# Altium schematic sheet servos.SchDoc: Eye servos
size A4; Organization: GPA Robotics; DocumentNumber: 3; Revision: REV 0; SheetNumber: 3; SheetTotal: 11
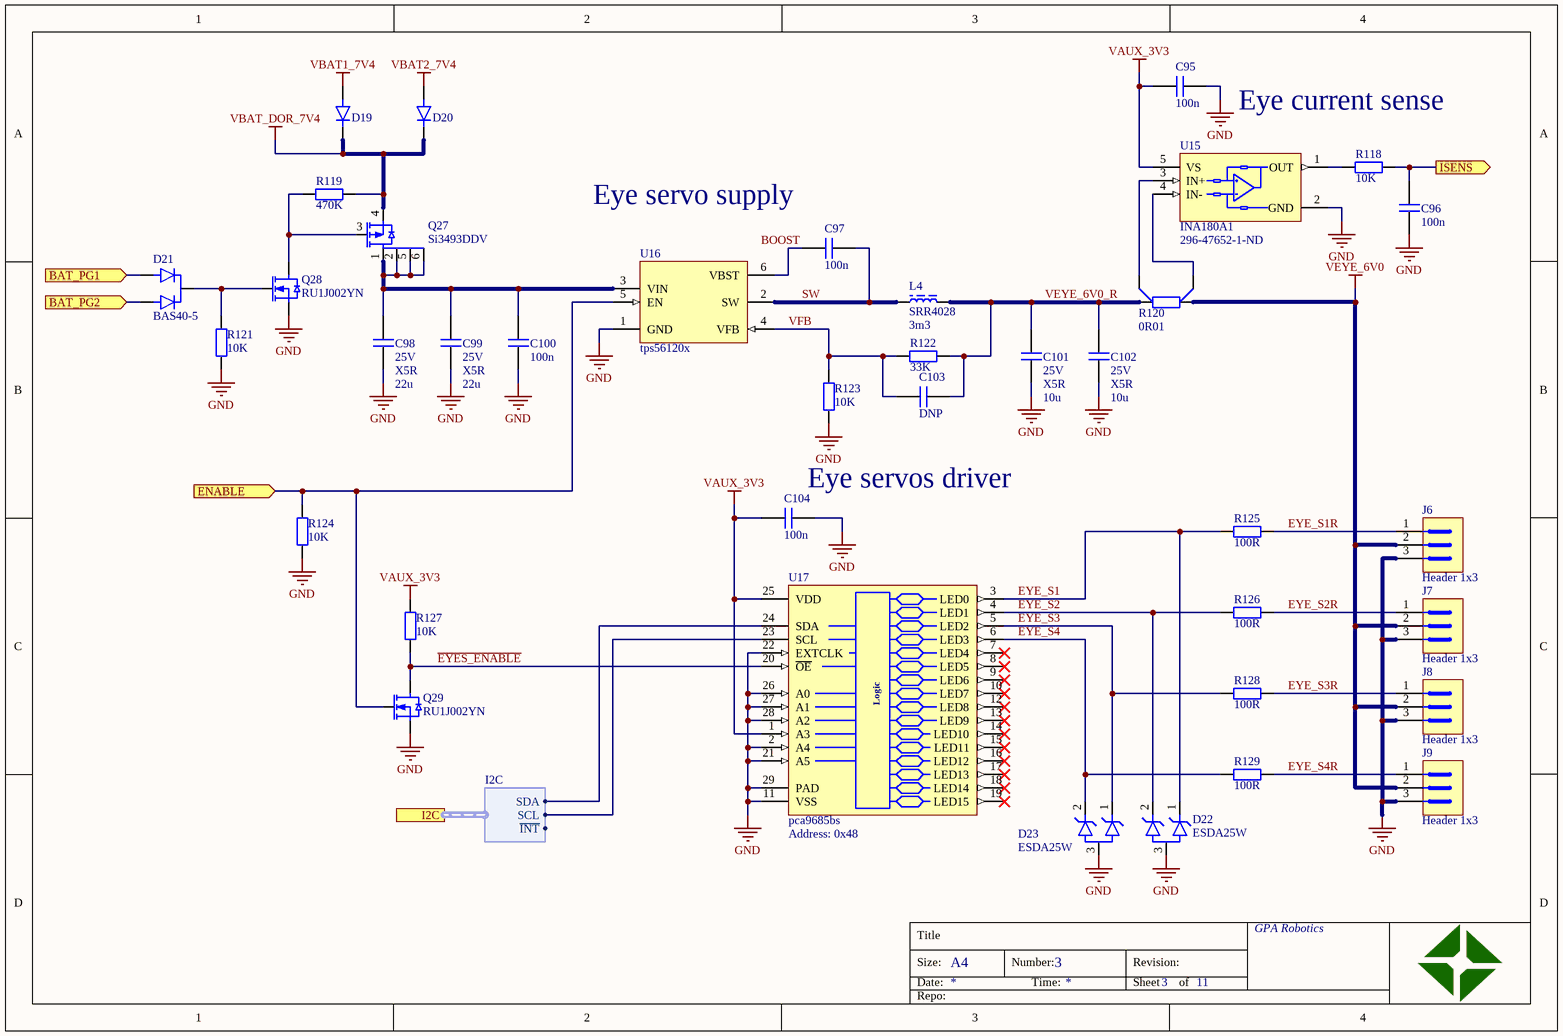
[diagram p0: servos.SchDoc]

## Parts
C95  value 100n  [CAPC1005X06N]  (hidden comment: cap)
C96  value 100n  [CAPC1005X06N]  (hidden comment: cap)
C97  value 100n  [CAPC1005X06N]  (hidden comment: cap)
C98  value 22u  voltage: 25V  type: X5R  [CAPC3216X14N]  (hidden comment: cap)
C99  value 22u  voltage: 25V  type: X5R  [CAPC3216X14N]  (hidden comment: cap)
C100  value 100n  [CAPC1005X06N]  (hidden comment: cap)
C101  value 10u  voltage: 25V  type: X5R  [CAPC3216X14N]  (hidden comment: cap)
C102  value 10u  voltage: 25V  type: X5R  [CAPC3216X14N]  (hidden comment: cap)
C103  value DNP  [CAPC1005X06N]  (hidden comment: cap)
C104  value 100n  [CAPC1005X06N]  (hidden comment: cap)
D19  DFLS2100  [SODFL370X100-2N_DFLS2100]  (value not drawn)
D20  DFLS2100  [SODFL370X100-2N_DFLS2100]  (value not drawn)
D21  BAS40-5  [SOT23_CC]
D22  ESDA25W  [SOT65P210X110-3N_SOT323-3L]
D23  ESDA25W  [SOT65P210X110-3N_SOT323-3L]
J6  Header 1x3  [HEADER_1x3_100MIL]
J7  Header 1x3  [HEADER_1x3_100MIL]
J8  Header 1x3  [HEADER_1x3_100MIL]
J9  Header 1x3  [HEADER_1x3_100MIL]
L4  SRR4028  value 3m3  [SRR4028]
Q27  Si3493DDV  [SOT95P284X110-6N_TSOP6]
Q28  RU1J002YN  [SOTFL65P210X105-3N]
Q29  RU1J002YN  [SOTFL65P210X105-3N]
R118  value 10K  [RESC1005X04N]  (hidden comment: res)
R119  value 470K  [RESC1005X04N]  (hidden comment: res)
R120  value 0R01  [4T_RESC1632X05N]  (hidden comment: res_4t)
R121  value 10K  [RESC1005X04N]  (hidden comment: res)
R122  value 33K  [RESC1005X04N]  (hidden comment: res)
R123  value 10K  [RESC1005X04N]  (hidden comment: res)
R124  value 10K  [RESC1005X04N]  (hidden comment: res)
R125  value 100R  [RESC1005X04N]  (hidden comment: res)
R126  value 100R  [RESC1005X04N]  (hidden comment: res)
R127  value 10K  [RESC1005X04N]  (hidden comment: res)
R128  value 100R  [RESC1005X04N]  (hidden comment: res)
R129  value 100R  [RESC1005X04N]  (hidden comment: res)
U15  INA180A1  Supplier Part Number 1: 296-47652-1-ND  [SOT95P280X145-5N]
U16  tps56120x  [SOT95P280X110-6N]
U17  pca9685bs  Address: 0x48  [QFN65P600X600X100_HS-29N_PCA9685BS]

## Ports
BAT_PG1 (in), BAT_PG2 (in), ENABLE (in), I2C (harness I2C), ISENS (out)

## Harnesses
I2C: SDA, SCL, ~{INT}

## Nets
GND: C95.1 C96.1 C98.1 C99.1 C100.1 C101.1 C102.1 C104.2 D22.3 D23.3 J6.3 J7.3 J8.3 J9.3 Q28.2(S) Q29.2(S) R121.1 R123.1 R124.1 U15.2(GND) U16.1(GND) U17.2(A4) U17.11(VSS) U17.21(A5) U17.22(EXTCLK) U17.26(A0) U17.27(A1) U17.28(A2) U17.29(PAD)
VAUX_3V3: C95.2 C104.1 R127.2 U15.5(VS) U17.1(A3) U17.25(VDD)
VBAT1_7V4: D19.A
VBAT2_7V4: D20.A
VBAT_DOR_7V4: D19.C D20.C Q27.4(S) R119.2
VEYE_6V0: J6.2 J7.2 J8.2 J9.2 R120.2
~{EYES_ENABLE}: Q29.3(D) R127.1 U17.20(~{OE})
BAT_PG1: D21.A1 ; port BAT_PG1
BAT_PG2: D21.A2 ; port BAT_PG2
BOOST: C97.1 U16.6(VBST)
ENABLE: Q29.1(G) R124.2 U16.5(EN) ; port ENABLE
EYE_S1: D22.1 R125.1 U17.3(LED0)
EYE_S1R: J6.1 R125.2
EYE_S2: D22.2 R126.1 U17.4(LED1)
EYE_S2R: J7.1 R126.2
EYE_S3: D23.1 R128.1 U17.5(LED2)
EYE_S3R: J8.1 R128.2
EYE_S4: D23.2 R129.1 U17.6(LED3)
EYE_S4R: J9.1 R129.2
ISENS: C96.2 R118.2 ; port ISENS
SW: C97.2 L4.1 U16.2(SW)
VEYE_6V0_R: C101.2 C102.2 C103.2 L4.2 R120.1 R122.2
VFB: C103.1 R122.1 R123.2 U16.4(VFB)
NetC98_2: C98.2 C99.2 C100.2 Q27.1(D) Q27.2(D) Q27.5(D) Q27.6(D) U16.3(VIN)
NetD21_C: D21.C Q28.1(G) R121.2
NetQ27_3: Q27.3(G) Q28.3(D) R119.1
NetR118_1: R118.1 U15.1(OUT)
NetR120_3: R120.3 U15.3(IN+)
NetR120_4: R120.4 U15.4(IN-)
NetU17_23: U17.23(SCL) ; port I2C.SCL
NetU17_24: U17.24(SDA) ; port I2C.SDA

Not connected (* = marked no-connect by the designer): U17 7(LED4)* 8(LED5)* 9(LED6)* 10(LED7)* 12(LED8)* 13(LED9)* 14(LED10)* 15(LED11)* 16(LED12)* 17(LED13)* 18(LED14)* 19(LED15)*

## Notes on the sheet
- Eye current sense
- Eye servo supply
- (near C104) Eye servos driver
- Title
- Size:
- Date:
- A4
- Number:
- Time:
- Revision:
- Sheet
- of
- Repo:
- (in symbol pca9685bs) Logic

## Library data of the parts
C95-C104 = cap: Capacitor; #digikey: *; #mouser: *
  C95-C97 C100 C103 C104: voltage: *; type: *
D19 D20 = dfls2100: 2.0A HIGH VOLTAGE SCHOTTKY BARRIER RECTIFIER; ComponentLink1Description: datasheet; ComponentLink1URL: https://www.diodes.com/assets/Datasheets/ds31475.pdf
D21 = diode_dual_cc: Diode Common Cathode
D22 D23 = esda25w: TRANSIL array for data protection; ComponentLink1Description: datasheet; ComponentLink1URL: https://www.st.com/content/ccc/resource/technical/document/datasheet/cd/9b/8d/39/1f/d4/43/ba/CD00064033.pdf/files/CD00064033.pdf/jcr:content/translations/en.CD00064033.pdf
J6-J9 = header_1x3_100mil: 2.54mm pitch single row header
Q27 = si3493ddv: P-Channel 20 V (D-S) MOSFET; ComponentLink1Description: datasheet; ComponentLink1URL: http://www.vishay.com/docs/62839/si7149adp.pdf
Q28 Q29 = ru1j002yn: N-channel 50V 200mA Small signal MOSFET; ComponentLink1Description: datasheet; ComponentLink1URL: https://www.mouser.se/datasheet/2/348/ru1j002yn-e-1018335.pdf
R118 R119 R121-R129 = res: Resistor; power: *; voltage: *; #digikey: *; #mouser: *
R120 = res_4t: Resistor; power: *; #digikey: *; #mouser: *
U15 = ina180a1: Low- and High-Side Voltage Output, Current-Sense Amplifiers; Datasheet: http://www.ti.com/lit/ds/symlink/ina180.pdf; #digikey: *; #mouser: *; Supplier 1: Digi-Key
U16 = tps56120x: 4.5-V to 17-V Input, 1-A Synchronous  Step-Down  Voltage  Regulator  in 6-Pin  SOT-23; #digikey: *; #mouser: *
U17 = pca9685bs: 16-channel, 12-bit PWM Fm+ I2C-bus LED controller; ComponentLink1Description: datasheet; ComponentLink1URL: https://www.nxp.com/docs/en/data-sheet/PCA9685.pdf
L4 = srr4028: ComponentLink1Description: series; ComponentLink1URL: https://www.bourns.com/docs/Product-Datasheets/SRR4028.pdf